# Altium schematic sheet Sensors.SchDoc
size A4
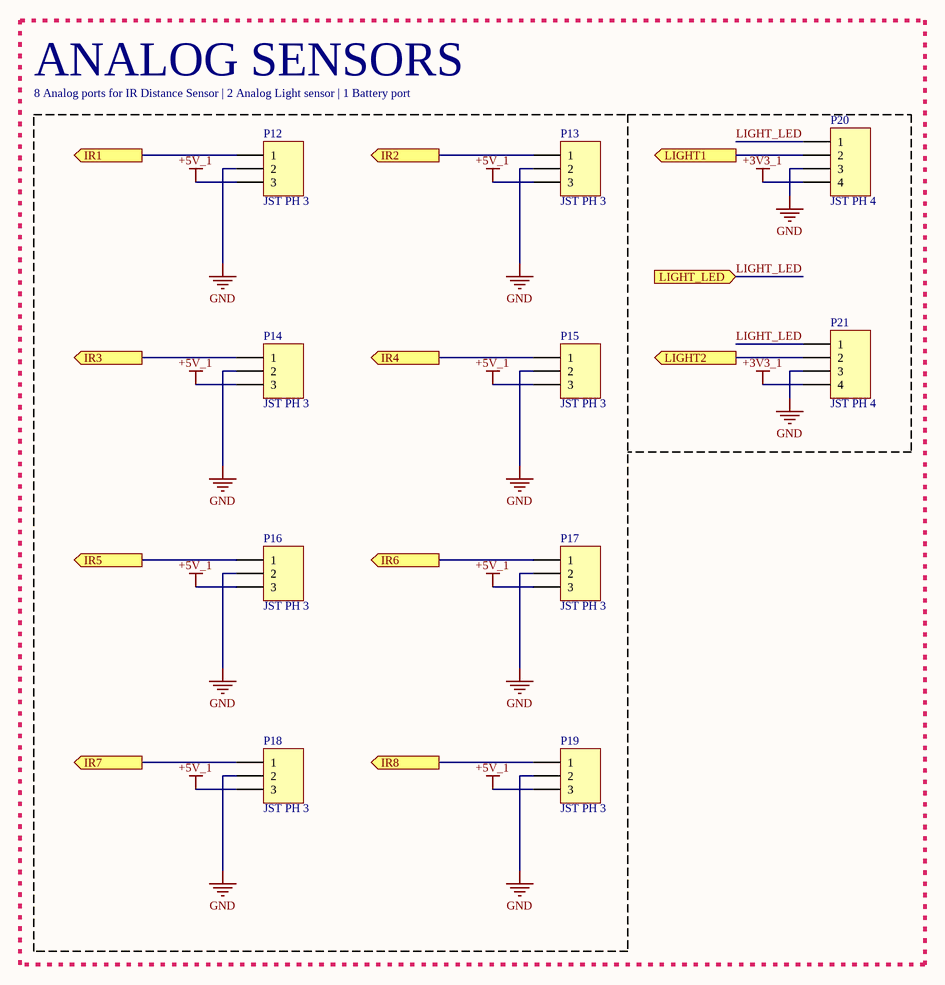
[diagram p0: Sensors.SchDoc]

## Parts
P12  JST PH 3  [B3B-PH-K]
P13  JST PH 3  [B3B-PH-K]
P14  JST PH 3  [B3B-PH-K]
P15  JST PH 3  [B3B-PH-K]
P16  JST PH 3  [B3B-PH-K]
P17  JST PH 3  [B3B-PH-K]
P18  JST PH 3  [B3B-PH-K]
P19  JST PH 3  [B3B-PH-K]
P20  JST PH 4  [B4B-PH-K]
P21  JST PH 4  [B4B-PH-K]

## Blocks framed on the sheet
ANALOG SENSORS: P12-P21

## Ports
IR1 (out), IR2 (out), IR3 (out), IR4 (out), IR5 (out), IR6 (out), IR7 (out), IR8 (out), LIGHT1 (out), LIGHT2 (out), LIGHT_LED (in)

## Nets
+3V3_1: P20.4 P21.4
+5V_1: P12.3 P13.3 P14.3 P15.3 P16.3 P17.3 P18.3 P19.3
GND: P12.2 P13.2 P14.2 P15.2 P16.2 P17.2 P18.2 P19.2 P20.3 P21.3
IR1: P12.1 ; port IR1
IR2: P13.1 ; port IR2
IR3: P14.1 ; port IR3
IR4: P15.1 ; port IR4
IR5: P16.1 ; port IR5
IR6: P17.1 ; port IR6
IR7: P18.1 ; port IR7
IR8: P19.1 ; port IR8
LIGHT1: P20.2 ; port LIGHT1
LIGHT2: P21.2 ; port LIGHT2
LIGHT_LED: P20.1 P21.1 ; port LIGHT_LED

## Notes on the sheet
- 8 Analog ports for IR Distance Sensor | 2 Analog Light sensor | 1 Battery port